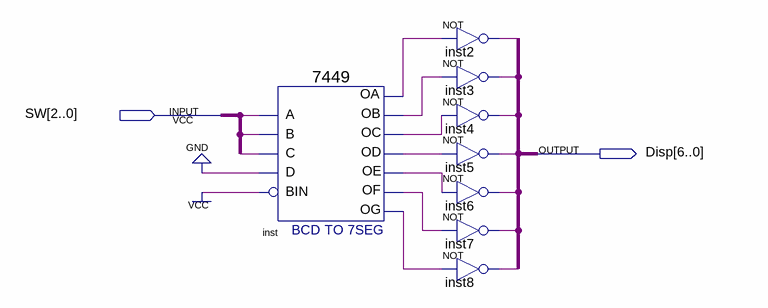
[diagram p0: schematic sheet]
// Quartus schematic 7_SEG.bdf as structural Verilog: 8 symbols, 2 pins
module \7_SEG  (
  input  [2:0] SW,
  output [6:0] Disp
);

  wire OA, OB, OC, OD, OE, OF, OG;

  \7449  inst (
    .A(SW[0]), .C(SW[2]), .B(SW[1]), .D(1'b0), .BIN(1'b1), .OC(OC), .OD(OD), .OF(OF), .OG(OG), .OB(OB),
    .OA(OA), .OE(OE));
  not inst2 (Disp[0], OA);
  not inst3 (Disp[1], OB);
  not inst4 (Disp[2], OC);
  not inst5 (Disp[3], OD);
  not inst6 (Disp[4], OE);
  not inst7 (Disp[5], OF);
  not inst8 (Disp[6], OG);
endmodule
